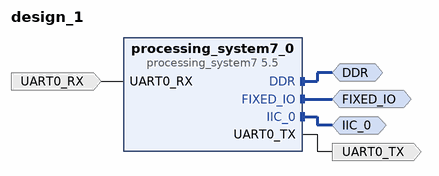
[diagram p0: block diagram of the top level]
# Vivado block design design_1, Vivado 2016.2
create_bd_design design_1

create_bd_intf_port -mode Master -vlnv xilinx.com:interface:ddrx_rtl:1.0 DDR
create_bd_intf_port -mode Master -vlnv xilinx.com:display_processing_system7:fixedio_rtl:1.0 FIXED_IO
create_bd_intf_port -mode Master -vlnv xilinx.com:interface:iic_rtl:1.0 IIC_0
create_bd_port -dir O UART0_TX
create_bd_port -dir I UART0_RX

create_bd_cell -type ip -vlnv xilinx.com:ip:processing_system7:5.5 processing_system7_0
set_property -dict [list \
  CONFIG.PCW_UIPARAM_DDR_FREQ_MHZ 525.0 \
  CONFIG.PCW_CRYSTAL_PERIPHERAL_FREQMHZ 50.0 \
  CONFIG.PCW_APU_PERIPHERAL_FREQMHZ 650.0 \
  CONFIG.PCW_USE_M_AXI_GP0 0 \
  CONFIG.PCW_EN_CLK0_PORT 0 \
  CONFIG.PCW_PRESET_BANK1_VOLTAGE {LVCMOS 1.8V} \
  CONFIG.PCW_UIPARAM_DDR_PARTNO {MT41K128M16 JT-125} \
  CONFIG.PCW_SD0_PERIPHERAL_ENABLE 1 \
  CONFIG.PCW_SD0_GRP_CD_ENABLE 1 \
  CONFIG.PCW_SD0_GRP_CD_IO {MIO 47} \
  CONFIG.PCW_SD0_GRP_WP_ENABLE 1 \
  CONFIG.PCW_UART0_PERIPHERAL_ENABLE 1 \
  CONFIG.PCW_UART1_PERIPHERAL_ENABLE 1 \
  CONFIG.PCW_CAN0_PERIPHERAL_ENABLE 1 \
  CONFIG.PCW_CAN0_CAN0_IO {MIO 14 .. 15} \
  CONFIG.PCW_CAN1_PERIPHERAL_ENABLE 1 \
  CONFIG.PCW_CAN1_CAN1_IO {MIO 12 .. 13} \
  CONFIG.PCW_I2C0_PERIPHERAL_ENABLE 1 \
] [get_bd_cells processing_system7_0]
# 17 more settings of processing_system7_0 are not shown: defaults, MIO pin electricals, DDR timing, and values the tool derives

# ---- connections ----

connect_bd_intf_net [get_bd_intf_ports DDR] [get_bd_intf_pins processing_system7_0/DDR]
connect_bd_intf_net [get_bd_intf_ports FIXED_IO] [get_bd_intf_pins processing_system7_0/FIXED_IO]
connect_bd_intf_net [get_bd_intf_ports IIC_0] [get_bd_intf_pins processing_system7_0/IIC_0]
connect_bd_net [get_bd_pins processing_system7_0/UART0_TX] [get_bd_ports UART0_TX]
connect_bd_net [get_bd_ports UART0_RX] [get_bd_pins processing_system7_0/UART0_RX]

validate_bd_design
save_bd_design
